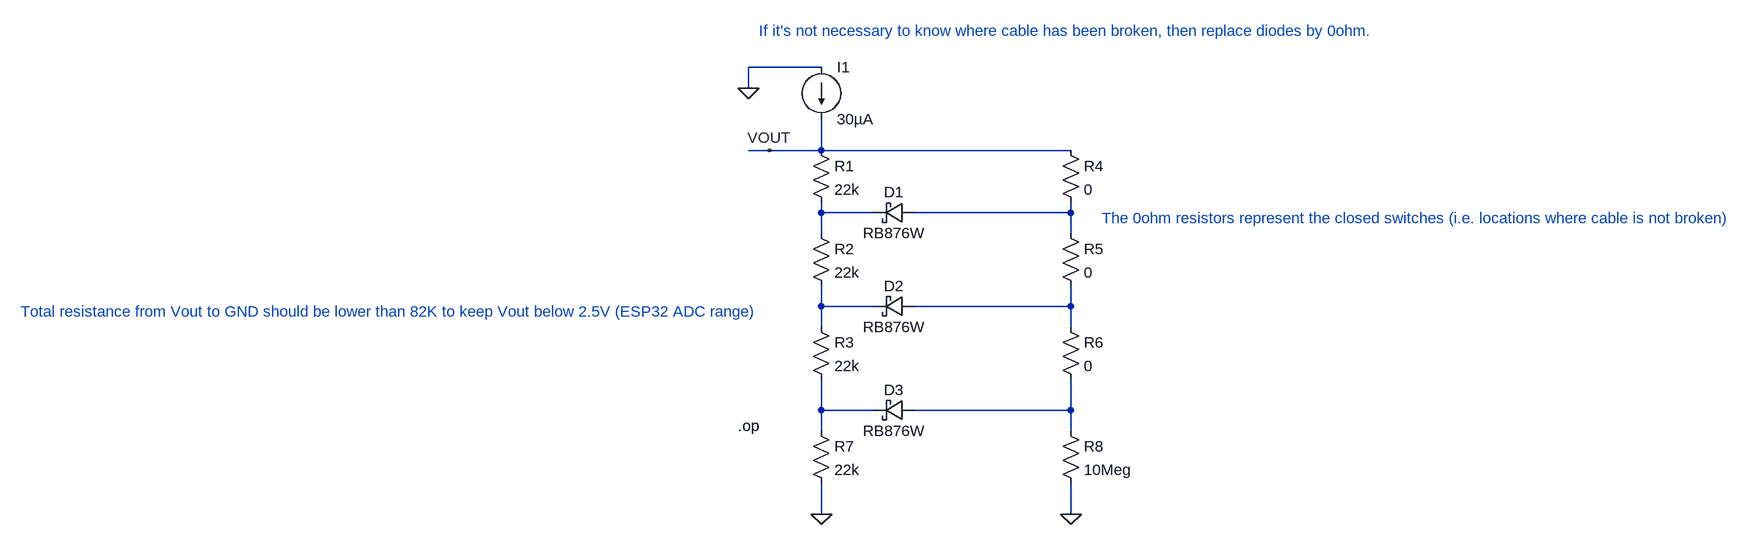
[diagram p0: schematic cable_break.asc]
cable_break.asc, the LTspice schematic file:
Version 4
SHEET 1 1664 788
WIRE 176 80 64 80
WIRE 64 112 64 80
WIRE 96 208 64 208
WIRE 176 208 176 160
WIRE 176 208 96 208
WIRE 560 208 176 208
WIRE 176 304 176 288
WIRE 256 304 176 304
WIRE 560 304 560 288
WIRE 560 304 320 304
WIRE 176 336 176 304
WIRE 560 336 560 304
WIRE 176 448 176 416
WIRE 256 448 176 448
WIRE 560 448 560 416
WIRE 560 448 320 448
WIRE 176 480 176 448
WIRE 560 480 560 448
WIRE 176 608 176 560
WIRE 256 608 176 608
WIRE 560 608 560 560
WIRE 560 608 320 608
WIRE 176 640 176 608
WIRE 560 640 560 608
WIRE 176 768 176 720
WIRE 560 768 560 720
FLAG 176 768 0
FLAG 560 768 0
FLAG 64 112 0
FLAG 96 208 VOUT
SYMBOL current 176 80 R0
WINDOW 123 0 0 Left 0
WINDOW 39 0 0 Left 0
SYMATTR InstName I1
SYMATTR Value 30µA
SYMBOL res 160 192 R0
SYMATTR InstName R1
SYMATTR Value 22k
SYMBOL res 160 320 R0
SYMATTR InstName R2
SYMATTR Value 22k
SYMBOL res 160 464 R0
SYMATTR InstName R3
SYMATTR Value 22k
SYMBOL schottky 320 288 R90
WINDOW 0 0 32 VBottom 2
WINDOW 3 32 32 VTop 2
SYMATTR InstName D1
SYMATTR Value RB876W
SYMATTR Description Diode
SYMATTR Type diode
SYMBOL schottky 320 432 R90
WINDOW 0 0 32 VBottom 2
WINDOW 3 32 32 VTop 2
SYMATTR InstName D2
SYMATTR Value RB876W
SYMATTR Description Diode
SYMATTR Type diode
SYMBOL res 544 192 R0
SYMATTR InstName R4
SYMATTR Value 0
SYMBOL res 544 320 R0
SYMATTR InstName R5
SYMATTR Value 0
SYMBOL res 544 464 R0
SYMATTR InstName R6
SYMATTR Value 0
SYMBOL res 160 624 R0
SYMATTR InstName R7
SYMATTR Value 22k
SYMBOL schottky 320 592 R90
WINDOW 0 0 32 VBottom 2
WINDOW 3 32 32 VTop 2
SYMATTR InstName D3
SYMATTR Value RB876W
SYMATTR Description Diode
SYMATTR Type diode
SYMBOL res 544 624 R0
SYMATTR InstName R8
SYMATTR Value 10Meg
TEXT 608 312 Left 2 ;The 0ohm resistors represent the closed switches (i.e. locations where cable is not broken)
TEXT 48 632 Left 2 !.op
TEXT 80 24 Left 2 ;If it's not necessary to know where cable has been broken, then replace diodes by 0ohm.
TEXT -1056 456 Left 2 ;Total resistance from Vout to GND should be lower than 82K to keep Vout below 2.5V (ESP32 ADC range)

The netlist it stands for:
* cable_break.asc
I1 0 VOUT 30µA
R1 VOUT N001 22k
R2 N001 N003 22k
R3 N003 N005 22k
D1 N002 N001 RB876W
D2 N004 N003 RB876W
R4 VOUT N002 0
R5 N002 N004 0
R6 N004 N006 0
R7 N005 0 22k
D3 N006 N005 RB876W
R8 N006 0 10Meg
.model D D
.lib standard.dio
* The 0ohm resistors represent the closed switches (i.e. locations where cable is not broken)
.op
* If it's not necessary to know where cable has been broken, then replace diodes by 0ohm.
* Total resistance from Vout to GND should be lower than 82K to keep Vout below 2.5V (ESP32 ADC range)
.backanno
.end